# EAGLE design PCB Design (EAGLE 9.1.3)

## Sheet 1 of 2
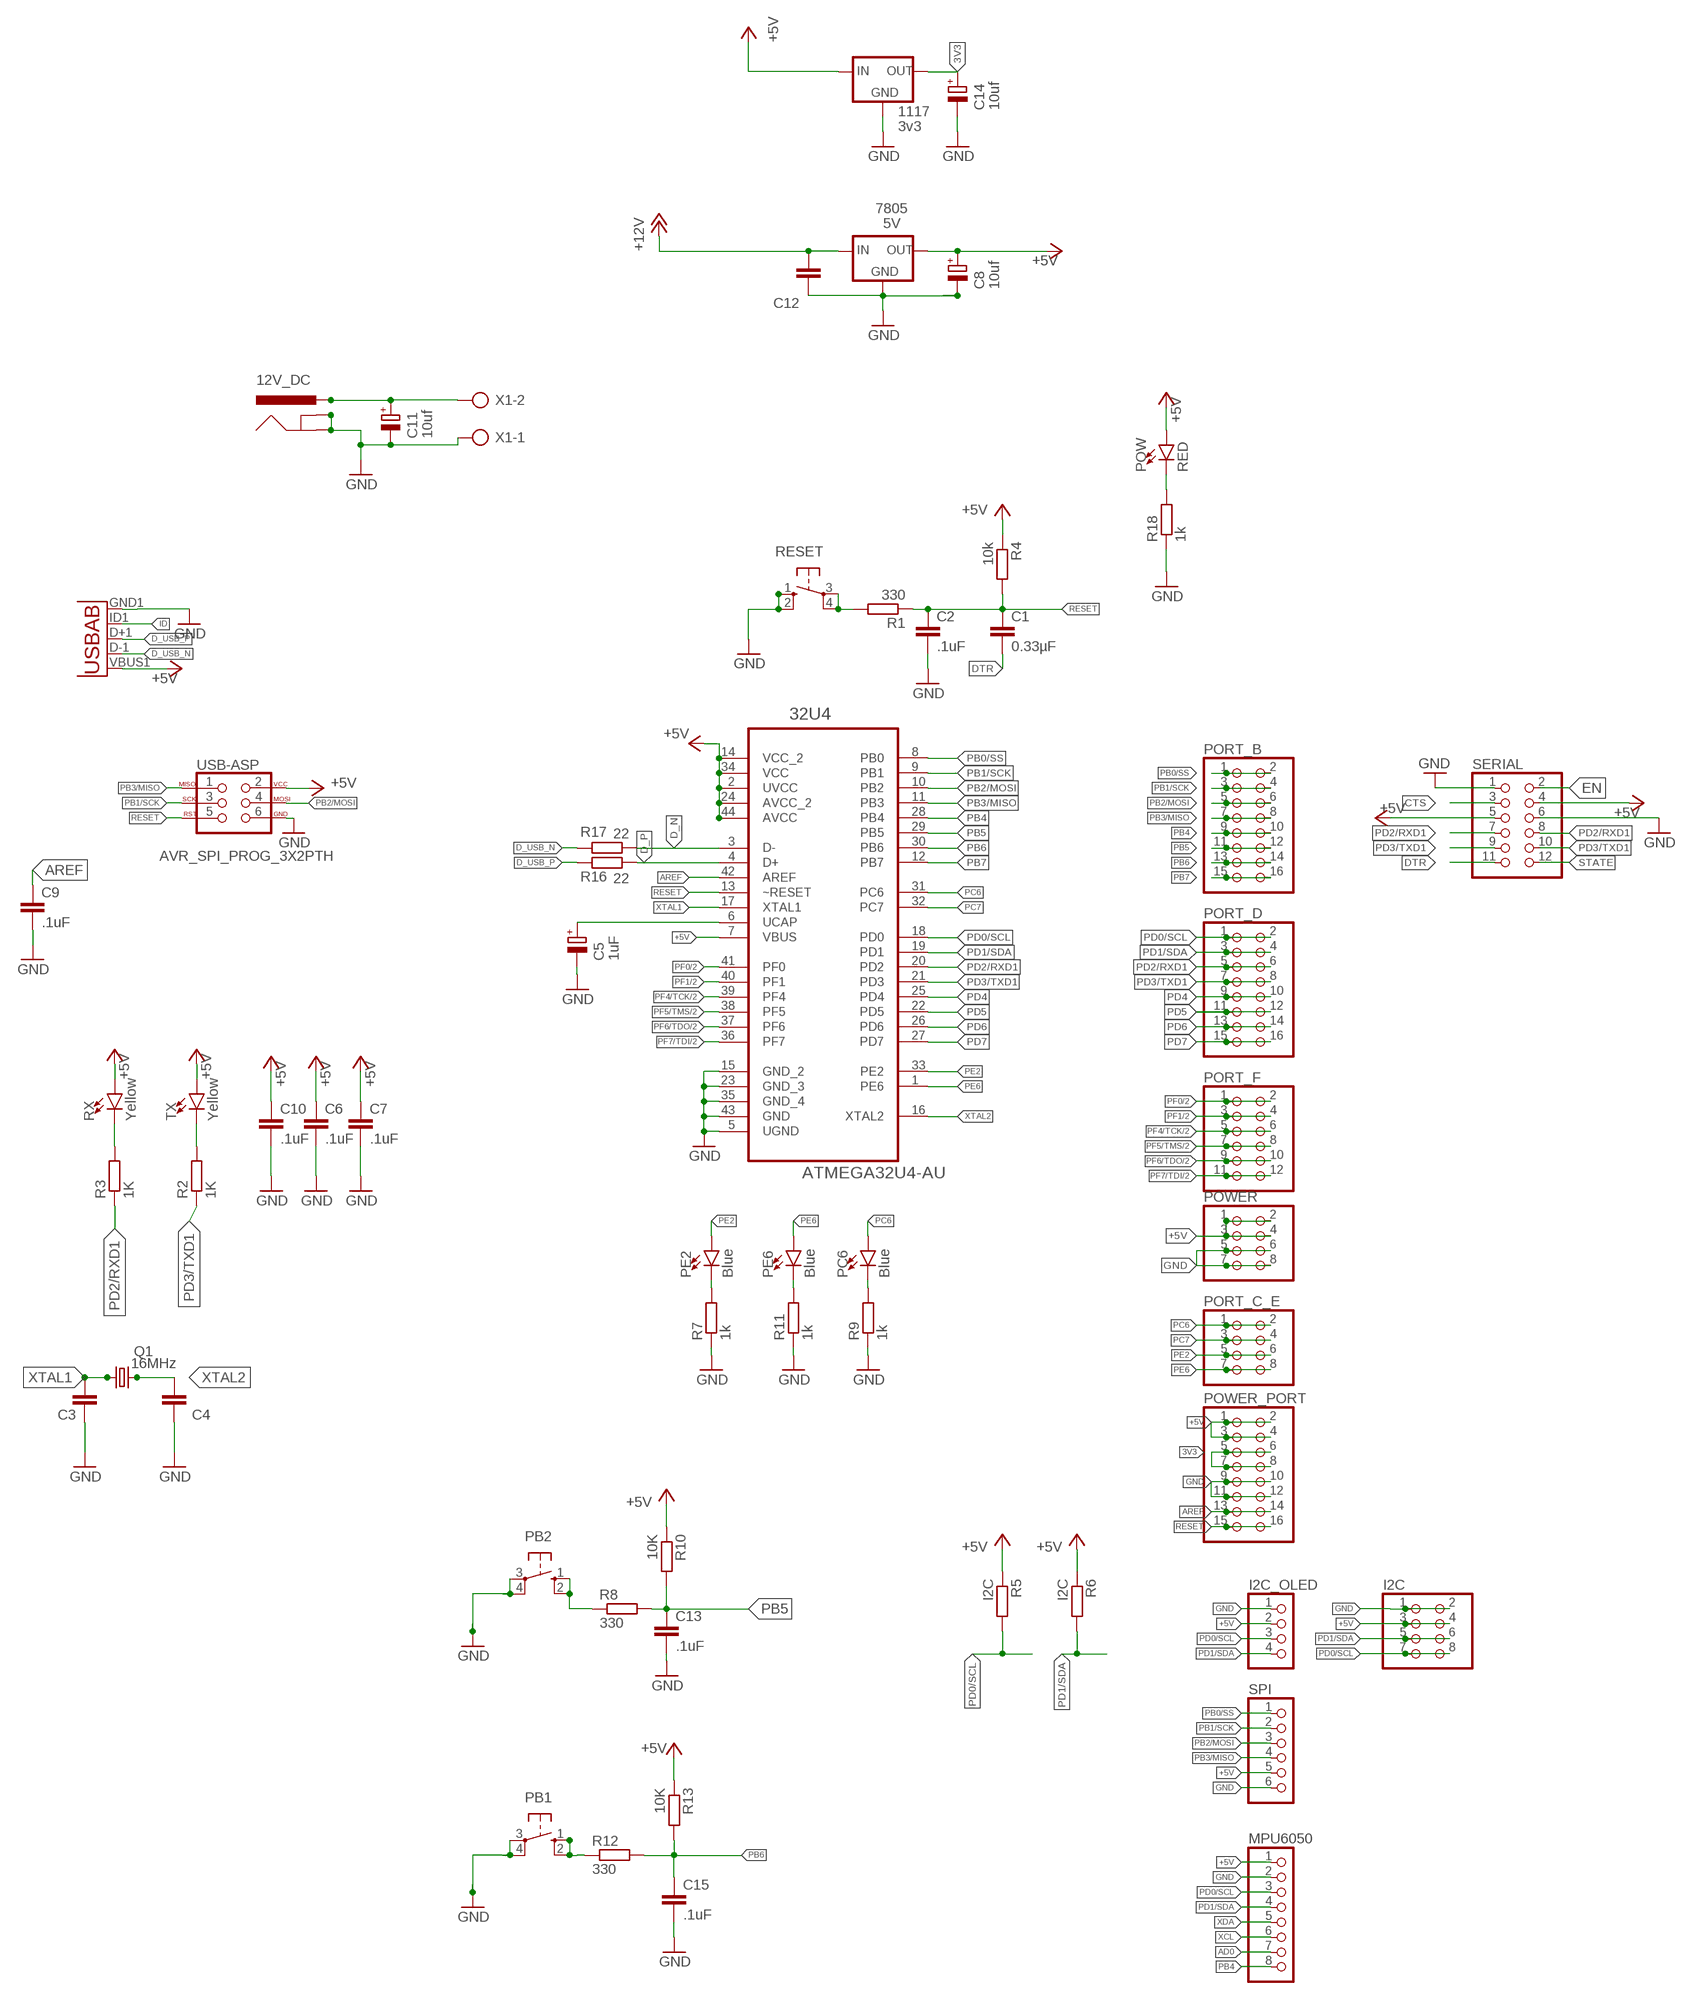
[diagram p0: schematic, sheet 1]

### Parts
12V_DC  POWER_JACK  [POWER_JACK_PTH]
32U4  ATMEGA32U4-AU  [QFP80P1200X1200X120-44N]
1117  3v3  V_REG_LD1117VXXLD1117-SMD  [SOT223]
7805  5V  V_REG_78XX7812  [TO-252]
C1  0.33µF  C-EUC0805K  [C0805K]
C2  .1uF  C-EUC0805K  [C0805K]
C3  22pF  C-EUC0805K  [C0805K]
C4  22pF  C-EUC0805K  [C0805K]
C5  1uF  CPOL-EUE2.5-6  [E2,5-6]
C6  .1uF  C-EUC0805K  [C0805K]
C7  .1uF  C-EUC0805K  [C0805K]
C8  10uf  CPOL-EUE2.5-6  [E2,5-6]
C9  .1uF  C-EUC0805K  [C0805K]
C10  .1uF  C-EUC0805K  [C0805K]
C11  10uf  CPOL-EUE2.5-6  [E2,5-6]
C12  .1uf  C-EUC0805K  [C0805K]
C13  .1uF  C-EUC0805K  [C0805K]
C14  10uf  CPOL-EUE2.5-6  [E2,5-6]
C15  .1uF  C-EUC0805K  [C0805K]
I2C  PINHD-2X4  [2X04]
I2C_OLED  PINHD-1X4  [1X04]
MPU6050  PINHD-1X8  [1X08]
PB1  10-XX  [B3F-10XX]
PB2  10-XX  [B3F-10XX]
PC6  Blue  LED-BLUE0603  [LED-0603]
PE2  Blue  LED-BLUE0603  [LED-0603]
PE6  Blue  LED-BLUE0603  [LED-0603]
PORT_B  PINHD-2X8  [2X08]
PORT_C_E  PINHD-2X4  [2X04]
PORT_D  PINHD-2X8  [2X08]
PORT_F  PINHD-2X6  [2X06]
POW  RED  LED-BLUE0603  [LED-0603]
POWER  PINHD-2X4  [2X04]
POWER_PORT  PINHD-2X8  [2X08]
Q1  16MHz  CRYSTALHC49U70  [HC49U70]
R1  330  R-EU_M0805  [M0805]
R2  1K  R-EU_M0805  [M0805]
R3  1K  R-EU_M0805  [M0805]
R4  10k  R-EU_M0805  [M0805]
R5  I2C  R-EU_M0805  [M0805]
R6  I2C  R-EU_M0805  [M0805]
R7  1k  R-EU_M0805  [M0805]
R8  330  R-EU_M0805  [M0805]
R9  1k  R-EU_M0805  [M0805]
R10  10K  R-EU_M0805  [M0805]
R11  1k  R-EU_M0805  [M0805]
R12  330  R-EU_M0805  [M0805]
R13  10K  R-EU_M0805  [M0805]
R16  22  R-EU_M0805  [M0805]
R17  22  R-EU_M0805  [M0805]
R18  1k  R-EU_M0805  [M0805]
RESET  10-XX  [B3F-10XX]
RX  Yellow  LED-BLUE0603  [LED-0603]
SERIAL  PINHD-2X6  [2X06]
SPI  PINHD-1X6  [1X06]
TX  Yellow  LED-BLUE0603  [LED-0603]
U1  USB""  [USB-MICRO-SMD]
USB-ASP  AVR_SPI_PROG_3X2PTH  [2X3]
X1  AK500/2-H  [AK500/2-H]

### Nets
3V3: 1117.2(OUT) C14.+ POWER_PORT.5 POWER_PORT.6 POWER_PORT.7 POWER_PORT.8
+5V: 32U4.2(UVCC) 32U4.7(VBUS) 32U4.14(VCC_2) 32U4.24(AVCC_2) 32U4.34(VCC) 32U4.44(AVCC) 1117.3(IN) 7805.2(OUT) C6.1 C7.1 C8.+ C10.1 I2C.3 I2C.4 I2C_OLED.2 MPU6050.1 POW.A POWER.1 POWER.2 POWER.3 POWER.4 POWER_PORT.1 POWER_PORT.2 POWER_PORT.3 POWER_PORT.4 R4.1 R5.1 R6.1 R10.1 R13.1 RX.A SERIAL.4 SERIAL.5 SPI.5 TX.A U1.VBUS1(VBUS) USB-ASP.2 ; also sheet 2
+12V: 12V_DC.PWR 7805.1(IN) C11.+ C12.1 X1.2
AD0: MPU6050.7
AREF: 32U4.42(AREF) C9.1 POWER_PORT.13 POWER_PORT.14
CTS: SERIAL.3
D_N: 32U4.3(D-) R17.1
D_P: 32U4.4(D+) R16.1
D_USB_N: R17.2 U1.D-1(D-)
D_USB_P: R16.2 U1.D+1(D+)
DTR: C1.2 SERIAL.11
EN: SERIAL.2
GND: 12V_DC.GND 12V_DC.GNDBREAK 32U4.5(UGND) 32U4.15(GND_2) 32U4.23(GND_3) 32U4.35(GND_4) 32U4.43(GND) 1117.1(GND) 7805.3(GND) C2.2 C3.1 C4.1 C5.- C6.2 C7.2 C8.- C9.2 C10.2 C11.- C12.2 C13.2 C14.- C15.2 I2C.1 I2C.2 I2C_OLED.1 MPU6050.2 PB1.3(P) PB1.4(P1) PB2.3(P) PB2.4(P1) POWER.5 POWER.6 POWER.7 POWER.8 POWER_PORT.9 POWER_PORT.10 POWER_PORT.11 POWER_PORT.12 R7.1 R9.1 R11.1 R18.1 RESET.1(S) RESET.2(S1) SERIAL.1 SERIAL.6 SPI.6 U1.GND1(GND) USB-ASP.6 X1.1 ; also sheet 2
ID: U1.ID1(USBID)
N$1: PC6.C R9.2
N$2: POW.C R18.2
N$3: PE6.C R11.2
N$7: PE2.C R7.2
N$8: R2.2 TX.C
N$9: R3.2 RX.C
N$10: R1.2 RESET.3(P) RESET.4(P1)
N$11: PB1.1(S) PB1.2(S1) R12.1
N$12: PB2.1(S) PB2.2(S1) R8.1
N$16: 32U4.6(UCAP) C5.+
PB0/SS: 32U4.8(PB0) PORT_B.1 PORT_B.2 SPI.1
PB1/SCK: 32U4.9(PB1) PORT_B.3 PORT_B.4 SPI.2 USB-ASP.3
PB2/MOSI: 32U4.10(PB2) PORT_B.5 PORT_B.6 SPI.3 USB-ASP.4
PB3/MISO: 32U4.11(PB3) PORT_B.7 PORT_B.8 SPI.4 USB-ASP.1
PB4: 32U4.28(PB4) MPU6050.8 PORT_B.9 PORT_B.10
PB5: 32U4.29(PB5) C13.1 PORT_B.11 PORT_B.12 R8.2 R10.2
PB6: 32U4.30(PB6) C15.1 PORT_B.13 PORT_B.14 R12.2 R13.2
PB7: 32U4.12(PB7) PORT_B.15 PORT_B.16
PC6: 32U4.31(PC6) PC6.A PORT_C_E.1 PORT_C_E.2
PC7: 32U4.32(PC7) PORT_C_E.3 PORT_C_E.4
PD0/SCL: 32U4.18(PD0) I2C.7 I2C.8 I2C_OLED.3 MPU6050.3 PORT_D.1 PORT_D.2 R5.2
PD1/SDA: 32U4.19(PD1) I2C.5 I2C.6 I2C_OLED.4 MPU6050.4 PORT_D.3 PORT_D.4 R6.2
PD2/RXD1: 32U4.20(PD2) PORT_D.5 PORT_D.6 R3.1 SERIAL.7 SERIAL.8
PD3/TXD1: 32U4.21(PD3) PORT_D.7 PORT_D.8 R2.1 SERIAL.9 SERIAL.10
PD4: 32U4.25(PD4) PORT_D.9 PORT_D.10
PD5: 32U4.22(PD5) PORT_D.11 PORT_D.12
PD6: 32U4.26(PD6) PORT_D.13 PORT_D.14
PD7: 32U4.27(PD7) PORT_D.15 PORT_D.16
PE2: 32U4.33(PE2) PE2.A PORT_C_E.5 PORT_C_E.6
PE6: 32U4.1(PE6) PE6.A PORT_C_E.7 PORT_C_E.8
PF0: 32U4.41(PF0) PORT_F.1 PORT_F.2 ; also sheet 2
PF1: 32U4.40(PF1) PORT_F.3 PORT_F.4 ; also sheet 2
PF4/TCK: 32U4.39(PF4) PORT_F.5 PORT_F.6 ; also sheet 2
PF5/TMS: 32U4.38(PF5) PORT_F.7 PORT_F.8 ; also sheet 2
PF6/TDO: 32U4.37(PF6) PORT_F.9 PORT_F.10 ; also sheet 2
PF7/TDI: 32U4.36(PF7) PORT_F.11 PORT_F.12 ; also sheet 2
RESET: 32U4.13(~RESET) C1.1 C2.1 POWER_PORT.15 POWER_PORT.16 R1.1 R4.2 USB-ASP.5
STATE: SERIAL.12
XCL: MPU6050.6
XDA: MPU6050.5
XTAL1: 32U4.17(XTAL1) C3.2 Q1.1
XTAL2: 32U4.16(XTAL2) C4.2 Q1.2

## Sheet 2 of 2
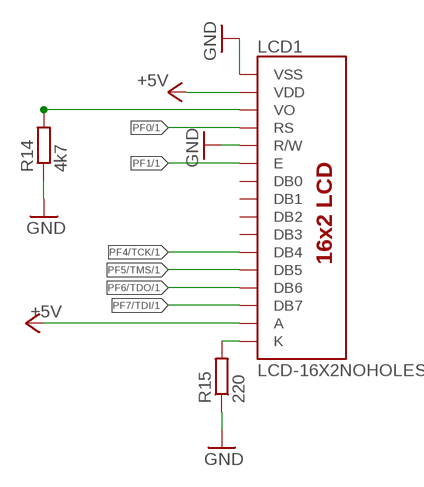
[diagram p1: schematic, sheet 2]

### Parts
LCD1  LCD-16X2NOHOLES  [LCD-16X2_NOHOLESNOSILK]
R14  4k7  R-EU_M0805  [M0805]
R15  220  R-EU_M0805  [M0805]

### Nets
+5V: LCD1.2(VDD) LCD1.15(A) ; also sheet 1
GND: LCD1.1(VSS) LCD1.5(R/W) R14.1 R15.1 ; also sheet 1
N$6: LCD1.3(VO) R14.2
N$14: LCD1.16(K) R15.2
PF0: LCD1.4(RS) ; also sheet 1
PF1: LCD1.6(E) ; also sheet 1
PF4/TCK: LCD1.11(DB4) ; also sheet 1
PF5/TMS: LCD1.12(DB5) ; also sheet 1
PF6/TDO: LCD1.13(DB6) ; also sheet 1
PF7/TDI: LCD1.14(DB7) ; also sheet 1
Unconnected: LCD1.7(DB0) LCD1.8(DB1) LCD1.9(DB2) LCD1.10(DB3)

## Library data of the parts
12V_DC = SparkFun-Connectors:POWER_JACK: Power Jack Connector This is the standard 5.5mm barrel jack for power. The PTH is the most common, proven, reliable, footprint. The Slot footprint only works if the mill layer is transmitted to the PCB fab house so be warned. Here are the connectors we sell at SparkFun: DC Barrel Power Jack/Connector <https://www.sparkfun.com/products/119> (PRT-00119) DC Barrel Power Jack/Connector (SMD) <https://www.sparkfun.com/products/12748> (PRT-12748) DC Barrel Jack Adapter - Breadboard Compatible <https://www.sparkfun.com/products/10811> (PRT-10811) It is used on this SparkFun product (and many, many others): SparkFun RedBoard - Programmed with Arduino <https://www.sparkfun.com/products/12757> (DEV-12757) Also, if you need a mating power supply or connector, please check these out: Wall Adapter Power Supply - 9VDC 650mA <https://www.sparkfun.com/products/298> (TOL-00298) DC Barrel Jack Adapter - Male <https://www.sparkfun.com/products/10287> (PRT-10287); MF: MULTICOMP; MPN: SPC21365; OC_FARNELL: 1310918; PROD_ID: CONN-08197
32U4 = ATMEGA32U4-AU:ATMEGA32U4-AU: 8-bit Microcontroller with ISP Flash and USB Controller; AVAILABILITY: Unavailable; DESCRIPTION: MCU 8-bit ATmega AVR RISC 32KB Flash 3.3V/5V 44-Pin TQFP; MF: Microchip; MP: ATMEGA32U4-AU; OC_FARNELL: unknown; PACKAGE: TQFP-44 Microchip; PRICE: None
1117 = SparkFun-IC-Power:V_REG_LD1117VXX: LD1117VXX voltage regulator. We carry the 3.3V version (COM-00526) in TO-220 package.; OC_FARNELL: unknown; PROD_ID: VREG-13917
7805 = SparkFun-IC-Power:V_REG_78XX: Voltage Regulator Standard 78xx regulator. IGO (Input Ground Output). Spark Fun Electronics SKU : COM-00107; OC_FARNELL: unknown; PROD_ID: VREG-12370; VALUE: +12v
C1-C4 C6 C7 C9 C10 C12 C13 C15 = rcl:C-EU: CAPACITOR, European symbol; OC_FARNELL: unknown
C5 C8 C11 C14 = resistor:CPOL-EU: POLARIZED CAPACITOR, European symbol; OC_FARNELL: unknown
I2C = pinhead:PINHD-2X4: PIN HEADER
I2C_OLED = pinhead:PINHD-1X4: PIN HEADER; OC_FARNELL: unknown
LCD1 = SparkFun-Displays:LCD-16X2: Standard text-only 16x2 parallel input LCD Basic 16 character by 2 line display. Typically utilizes the extremely common HD44780 parallel interface chipset SparkFun Products: Basic 16x2 Green <https://www.sparkfun.com/products/255> Basic 8x2 Green <https://www.sparkfun.com/products/11122>; OC_FARNELL: unknown; SF_ID: LCD-00255
MPU6050 = pinhead:PINHD-1X8: PIN HEADER; OC_FARNELL: unknown
PB1 PB2 RESET = switch-omron:10-XX: OMRON SWITCH; MF: OMRON; MPN: B3F-1000; OC_FARNELL: 176432; OC_NEWARK: 36M3542
PC6 PE2 PE6 POW RX TX = SparkFun-LED:LED-BLUE: Blue SMD LED Used in manufacturing of various products at SparkFun Packages: 0603 - SMD 0603 package [Product Link] <http://www.digikey.com/product-detail/en/SMLE12BC7TT86/511-1589-2-ND/1641808> 1206 - SMD1206 package [Product Link] <http://www.digikey.com/product-detail/en/lite-on-inc/LTST-C150TBKT/160-1643-1-ND/573584> SparkFun Products: ESP8266 Thing-Dev Board <https://www.sparkfun.com/products/13711> RedBoard <https://www.sparkfun.com/products/12757>; OC_FARNELL: unknown; PROD_ID: DIO-08575; VALUE: BLUE
PORT_B PORT_D POWER_PORT = pinhead:PINHD-2X8: PIN HEADER; OC_FARNELL: unknown
PORT_C_E POWER = pinhead:PINHD-2X4: PIN HEADER; OC_FARNELL: unknown
PORT_F = pinhead:PINHD-2X6: PIN HEADER; OC_FARNELL: unknown
Q1 = crystal:CRYSTAL: CRYSTAL; OC_FARNELL: unknown; OC_NEWARK: unknown
R1-R18 = resistor:R-EU_: RESISTOR, European symbol; OC_FARNELL: unknown
SERIAL = pinhead:PINHD-2X6: PIN HEADER
SPI = pinhead:PINHD-1X6: PIN HEADER; OC_FARNELL: unknown
U1 = MicroUSB:USB: This is a USB AB connector that is compatible with USB OTG. i.e. this connector can serve as a host or device
USB-ASP = SparkFun-Connectors:AVR_SPI_PROG_3X2: AVR ISP 6 Pin This is the reduced ISP connector for AVR programming. Common on Arduino. This footprint will take up less PCB space and can be used with a 10-pin to 6-pin adapter such as SKU: BOB-08508 **Special note about "TEST_POINT" package. The stop mask is on the top side, so if you want your programming test points to be on the bottom of your board, make sure to place this package on the bottom side of the board. This also ensure that the orientation to program from the bottom side will be correct. SparkFun Products: SparkFun ISP Pogo Adapter <https://www.sparkfun.com/products/11591> - NS Tiny AVR Programmer <https://www.sparkfun.com/products/11801> -PTH; OC_FARNELL: unknown
X1 = con-ptr500:AK500/2-H: CONNECTOR Aug. 2004 / PTR Meßtechnik: Die Bezeichnung der Serie AK505 wurde geändert. Es handelt sich hierbei um AK500 in horizontaler Ausführung.; OC_FARNELL: unknown; OC_NEWARK: unknown

## Board
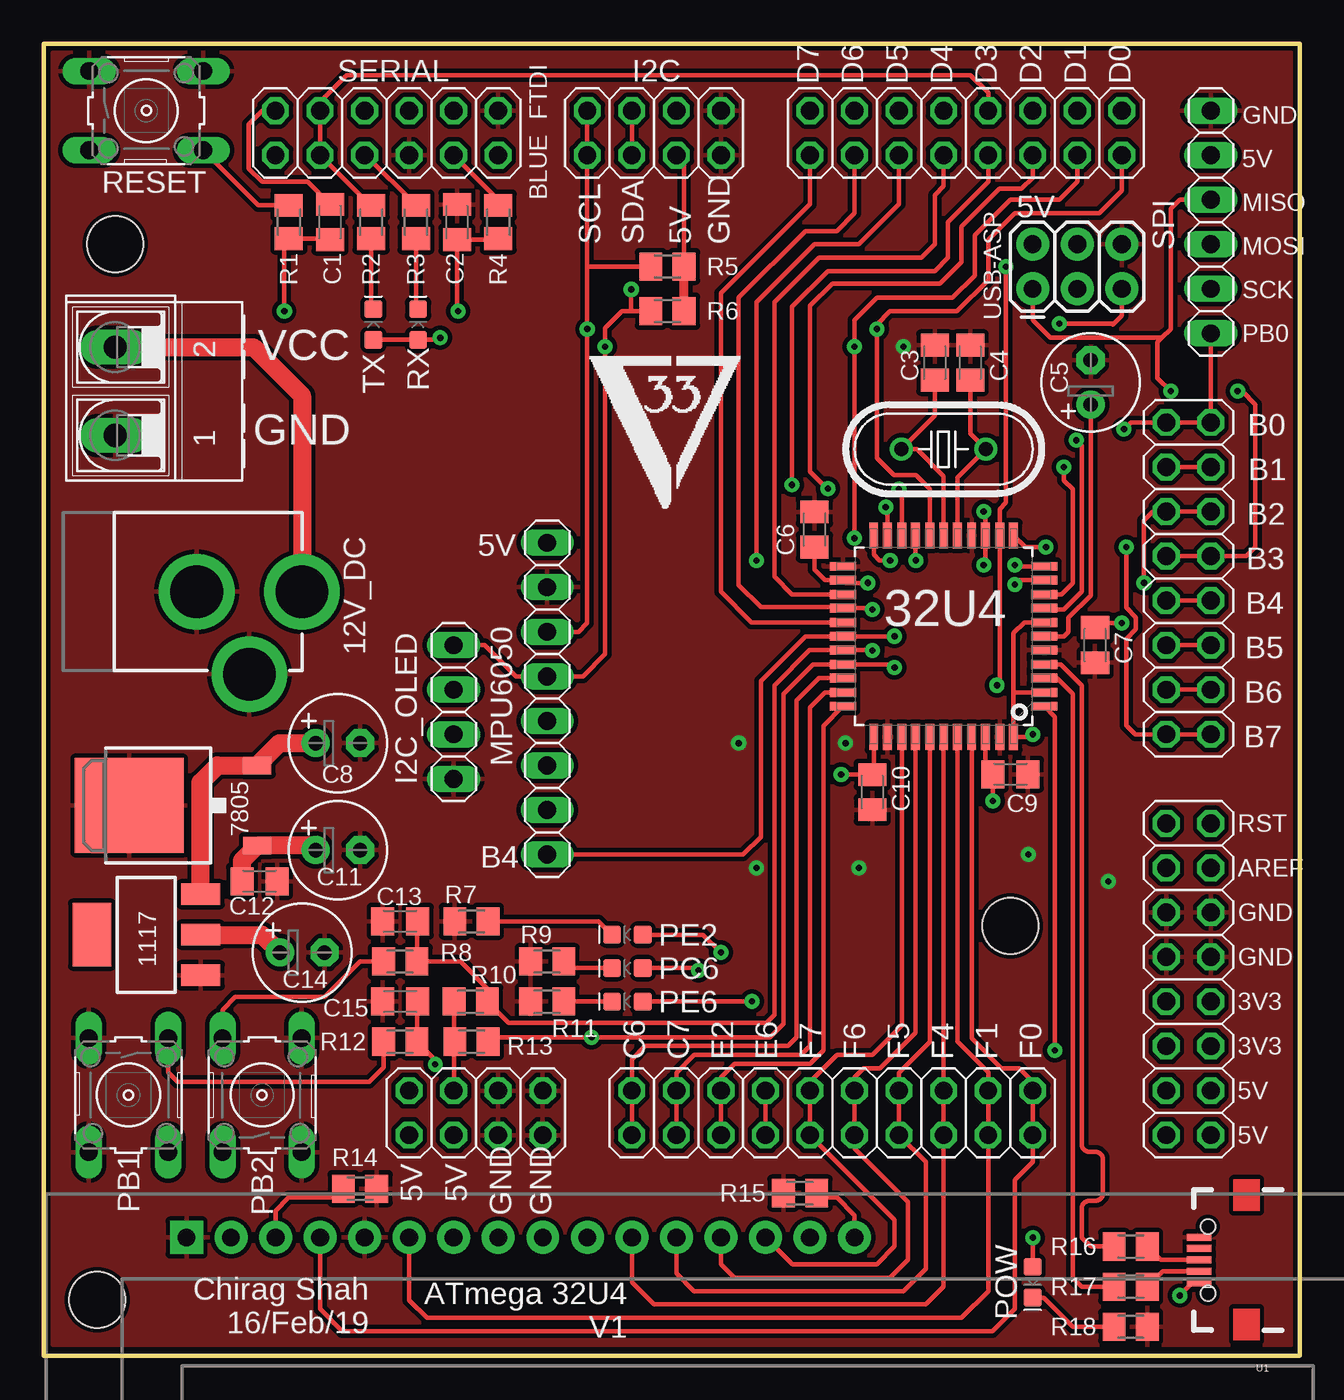
[diagram p2: board, top side]
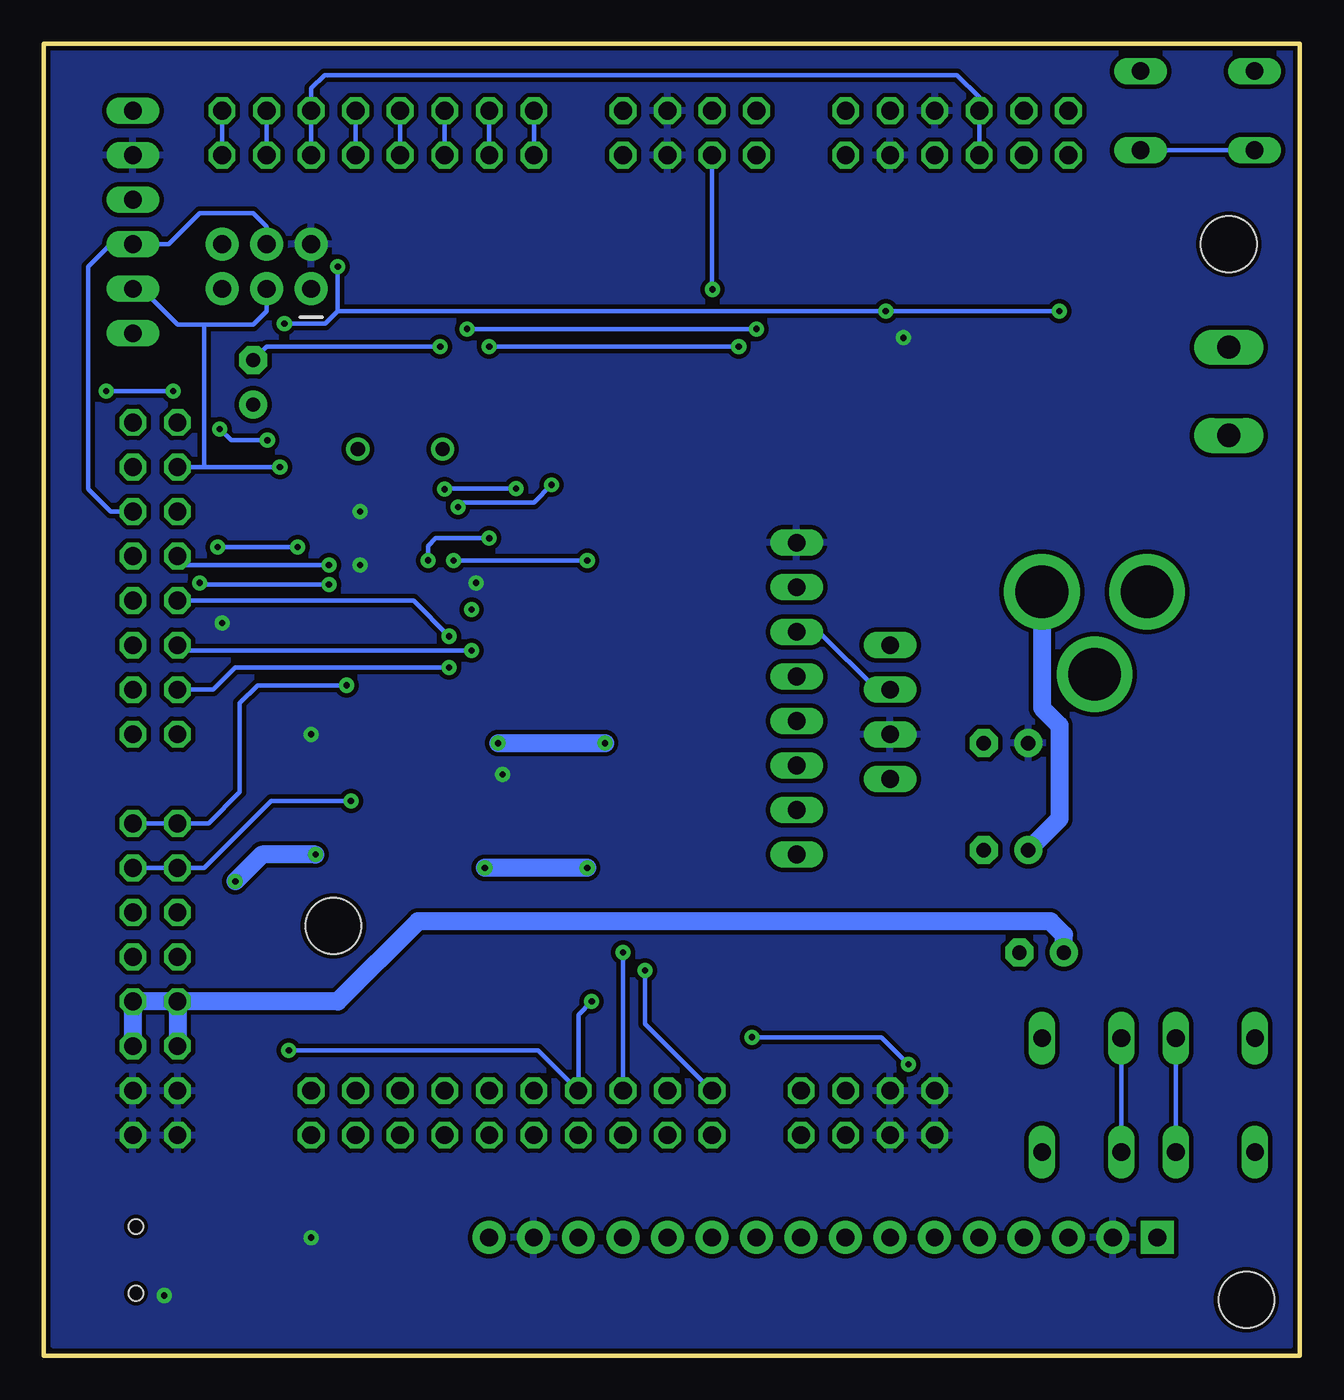
[diagram p3: board, bottom side, seen from below]

Size 71.63 x 74.8 mm. Coordinates in mm from the lower left corner, seen from the top.
Outline: 0,74.8 71.63,74.8 71.63,0 0,0 0,74.8
Copper layers (1*16): Top 0.035mm / dielectric 1.5mm / Bottom 0.035mm
Design rules "SparkFun-2-layer-STANDARD *": minimum track width 10mil, minimum drill 13.5mil, track to track 10mil, track to pad 8mil, pad to pad 8mil, via to via 10mil, smd to smd 8mil, copper to edge 8mil, drill to drill 8mil, minimum pad ring 10mil, minimum via ring 10mil, stop-mask expansion 4mil, vias tented up to drill 25mil, thermal gap 10mil
Holes 3.2 mm at 3.05,3.18 4.06,63.37 55.12,24.51

### Footprints (pad centres in the part's own frame; a part is rotated, then mirrored left to right if it is on the bottom)
POWER_JACK_PTH = drill 2.997 pad 4.318: GND 0,7.7; GNDBREAK 4.7,10.7; PWR 0,13.7
QFP80P1200X1200X120-44N = smd 1.473 x 0.508: 1 -5.74,3.988; 2 -5.74,3.2; 3 -5.74,2.388; 4 -5.74,1.6; 5 -5.74,0.787; 6 -5.74,0; 7 -5.74,-0.787; 8 -5.74,-1.6; 9 -5.74,-2.388; 10 -5.74,-3.2; 11 -5.74,-3.988; 23 5.74,-3.988; 24 5.74,-3.2; 25 5.74,-2.388; 26 5.74,-1.6; 27 5.74,-0.787; 28 5.74,0; 29 5.74,0.787; 30 5.74,1.6; 31 5.74,2.388; 32 5.74,3.2; 33 5.74,3.988 | smd 0.508 x 1.473: 12 -3.988,-5.74; 13 -3.2,-5.74; 14 -2.388,-5.74; 15 -1.6,-5.74; 16 -0.787,-5.74; 17 0,-5.74; 18 0.787,-5.74; 19 1.6,-5.74; 20 2.388,-5.74; 21 3.2,-5.74; 22 3.988,-5.74; 34 3.988,5.74; 35 3.2,5.74; 36 2.388,5.74; 37 1.6,5.74; 38 0.787,5.74; 39 0,5.74; 40 -0.787,5.74; 41 -1.6,5.74; 42 -2.388,5.74; 43 -3.2,5.74; 44 -3.988,5.74
SOT223 = smd 1.219 x 2.235: 1 -2.311,-3.099; 2 0,-3.099; 3 2.311,-3.099 | smd 3.6 x 2.2: 4 0,3.099
TO-252 = smd 1 x 1.6: 1 -2.28,-4.8; 2 2.28,-4.8 | smd 5.4 x 6.2: 3 0,2.5
C0805K = smd 1.3 x 1.6: 1 -1,0; 2 1,0
E2,5-6 = drill 0.813 pad 1.6: + -1.27,0 | drill 0.813 pad 1.6 octagon: - 1.27,0
2X04 = drill 1.016 octagon: 1 -3.81,-1.27; 2 -3.81,1.27; 3 -1.27,-1.27; 4 -1.27,1.27; 5 1.27,-1.27; 6 1.27,1.27; 7 3.81,-1.27; 8 3.81,1.27
1X04 = drill 1.016 long: 1 -3.81,0; 2 -1.27,0; 3 1.27,0; 4 3.81,0
LCD-16X2_NOHOLESNOSILK = drill 1.016 pad 1.88 square: 1 -32,15.5 | drill 1.016 pad 1.88: 2 -29.46,15.5; 3 -26.92,15.5; 4 -24.38,15.5; 5 -21.84,15.5; 6 -19.3,15.5; 7 -16.76,15.5; 8 -14.22,15.5; 9 -11.68,15.5; 10 -9.14,15.5; 11 -6.6,15.5; 12 -4.06,15.5; 13 -1.52,15.5; 14 1.02,15.5; 15 3.56,15.5; 16 6.1,15.5
1X08 = drill 1.016 long: 1 -8.89,0; 2 -6.35,0; 3 -3.81,0; 4 -1.27,0; 5 1.27,0; 6 3.81,0; 7 6.35,0; 8 8.89,0
B3F-10XX = drill 1.016 long: 1 -3.251,2.261; 2 3.251,2.261; 3 -3.251,-2.261; 4 3.251,-2.261
LED-0603 = smd 1 x 1: A -0.877,0; C 0.877,0
2X08 = drill 1.016 octagon: 1 -8.89,-1.27; 2 -8.89,1.27; 3 -6.35,-1.27; 4 -6.35,1.27; 5 -3.81,-1.27; 6 -3.81,1.27; 7 -1.27,-1.27; 8 -1.27,1.27; 9 1.27,-1.27; 10 1.27,1.27; 11 3.81,-1.27; 12 3.81,1.27; 13 6.35,-1.27; 14 6.35,1.27; 15 8.89,-1.27; 16 8.89,1.27
2X06 = drill 1.016 octagon: 1 -6.35,-1.27; 2 -6.35,1.27; 3 -3.81,-1.27; 4 -3.81,1.27; 5 -1.27,-1.27; 6 -1.27,1.27; 7 1.27,-1.27; 8 1.27,1.27; 9 3.81,-1.27; 10 3.81,1.27; 11 6.35,-1.27; 12 6.35,1.27
HC49U70 = drill 0.813: 1 -2.413,0; 2 2.413,0
M0805 = smd 1.3 x 1.6: 1 -0.95,0; 2 0.95,0
1X06 = drill 1.016 long: 1 -6.35,0; 2 -3.81,0; 3 -1.27,0; 4 1.27,0; 5 3.81,0; 6 6.35,0
USB-MICRO-SMD = smd 1.4 x 0.4: D+1 2.7,0; D-1 2.7,0.65; GND1 2.7,-1.3; ID1 2.7,-0.65; VBUS1 2.7,1.3 | hole 0.85: 2.2,1.9; 2.2,-1.9
2X3 = drill 1.016 pad 1.88: 1 0,0; 2 0,2.54; 3 2.54,0; 4 2.54,2.54; 5 5.08,0; 6 5.08,2.54
AK500/2-H = drill 1.321 long: 1 -2.515,0; 2 2.515,0

### Placement (x,y rotation side)
12V_DC  1.02,43.56 270 top
32U4  51.31,41.02 180 top
1117  5.84,24 90 top
7805  7.37,31.37 90 top
C1  16.32,64.64 90 top
C2  23.56,64.64 90 top
C3  50.8,56.63 270 top
C4  52.83,56.63 270 top
C5  59.69,55.5 90 top
C6  43.94,47.12 90 top
C7  59.94,40.51 270 top
C8  16.76,34.92 0 top
C9  55.12,33.15 0 top
C10  47.24,32.13 270 top
C11  16.76,28.83 0 top
C12  12.3,27.05 0 top
C13  20.32,24.77 180 top
C14  14.73,22.99 0 top
C15  20.32,20.19 180 top
I2C  34.8,69.72 180 top
I2C_OLED  23.37,36.7 90 top
LCD1  40.13,-8.76 0 top
MPU6050  28.7,37.47 270 top
PB1  4.83,14.86 270 top
PB2  12.45,14.86 90 top
PC6  33.27,22.1 180 top
PE2  33.27,24 180 top
PE6  33.27,20.19 180 top
PORT_B  65.28,44.32 270 top
PORT_C_E  37.34,13.84 0 top
PORT_D  52.58,69.72 180 top
PORT_F  50.04,13.84 180 top
POW  56.39,4.19 270 top
POWER  24.64,13.84 0 top
POWER_PORT  65.28,21.46 90 top
Q1  51.31,51.69 0 top
R1  13.97,64.64 90 top
R2  18.66,64.64 270 top
R3  21.22,64.64 270 top
R4  25.91,64.64 270 top
R5  35.56,62.1 180 top
R6  35.56,59.56 180 top
R7  24.38,24.77 0 top
R8  20.32,22.48 0 top
R9  28.7,22.48 0 top
R10  24.34,20.19 0 top
R11  28.7,20.19 0 top
R12  20.32,17.91 0 top
R13  24.38,17.91 0 top
R14  18.03,9.53 180 top
R15  43.12,9.27 0 top
R16  61.98,6.22 0 top
R17  61.98,3.94 0 top
R18  61.98,1.65 180 top
RESET  5.84,70.99 0 top
RX  21.34,58.8 90 top
SERIAL  19.56,69.72 180 top
SPI  66.55,64.64 90 top
TX  18.8,58.8 90 top
U1  68.58,5.46 180 top
USB-ASP  56.39,60.83 0 top
X1  4.06,54.99 90 top

### Tracks (layer width: path | path; a pad name or v marks a point on that pad's centre or on a via)
3V3
  Top 1.016: 1117.2 12.45,24 C14.+
  Bottom 1.016: POWER_PORT.5 POWER_PORT.7 POWER_PORT.8 | POWER_PORT.8 POWER_PORT.6 | C14.+ 13.46,24 14.22,24.77 50.29,24.77 54.86,20.19 POWER_PORT.8
+5V  (via drill 0.35)
  Top 0.254: v53.59,48.13 53.7,48.03 32U4.14 53.7,45.19 v53.59,45.09 | 32U4.34 47.32,33.21 C10.1 45.48,33.13 v45.47,33.15 | 32U4.7 55.91,41.81 55.3,41.2 55.3,37.72 | 55.3,37.72 32U4.44 56.24,35.28 v56.39,35.43 | 32U4.2 55.4,37.82 55.3,37.72 | R4.1 25.81,65.5 25.81,66.01 SERIAL.4 | TX.A RX.A 22.49,57.92 v22.61,58.04 | POWER.4 23.39,15.13 R10.1 23.39,17.95 R13.1 | 7805.2 | v46.99,44.07 45.72,44.07 32U4.24 44.55,44.22 43.94,44.83 C6.1 | POW.A v56.39,6.73 | U1.VBUS1 65.5,4.16 v64.77,3.43 | C7.1 60.2,41.77 v61.47,41.77 | I2C.4 36.51,68.01 R5.1
  Top 0.508: R6.1 R5.1
  Top 1.016: 7805.2 13.44,34.92 C8.+ | 1117.3 8.94,32.69 9.91,33.66 7805.2
  pour Bottom (isolate 0.254): 0.51,74.29 71.12,74.29 71.12,0.64 0.51,0.64
+12V
  Top 0.254: C11.+ 15.23,29.09
  Top 1.016: 15.23,29.09 7805.1 11.3,28.23 C12.1 | X1.2 10.16,57.51 11.96,57.51 14.72,54.75 12V_DC.PWR
  Bottom 1.016: 12V_DC.PWR 14.72,36.94 13.72,35.94 13.72,30.61 C11.+
AREF  (via drill 0.35)
  Top 0.254: v54.12,31.62 C9.1 53.7,33.57 32U4.42
  Bottom 0.254: POWER_PORT.13 POWER_PORT.14 62.48,27.81 58.67,31.62 v54.12,31.62
D_N
  Top 0.254: 32U4.3 57.76,38.63 58.67,37.72 58.67,4.45 59.18,3.94 R17.1
D_P
  Top 0.254: 32U4.4 57.99,39.42 59.18,38.23 59.18,12.07 arc90 59.63,11.62 59.95,11.62 arc-90 60.39,11.18 60.39,9.27 arc-90 59.95,8.83 59.63,8.83 arc90 59.18,8.38 59.18,6.73 59.69,6.22 R16.1
D_USB_N
  Top 0.254: U1.D-1 63.8,4.81 R17.2
D_USB_P
  Top 0.254: U1.D+1 65.79,5.46 63.69,5.46 R16.2
DTR
  Top 0.254: C1.2 15.03,66.93 12.45,66.93 11.68,67.69 11.68,70.23 12.45,70.99 SERIAL.11
GND  (via drill 0.35)
  Bottom 0.254: C5.- 58.93,57.53 v49.02,57.53 | 41.66,34.92 41.45,34.92
  Bottom 1.016: v40.64,27.81 v46.48,27.81 | v45.72,34.92 41.66,34.92 | 41.45,34.92 v39.62,34.92 | v56.13,28.57 59.18,28.57 v60.71,27.05
  pour Top (isolate 0.254): 71.12,0.64 71.12,74.29 0.51,74.29 0.51,0.64
N$1
  Top 0.254: PC6.C 30.03,22.1 R9.2
N$2
  Top 0.254: R18.2 58.67,1.65 57.01,3.31 POW.C
N$3
  Top 0.254: PE6.C R11.2
N$6
  Top 0.254: R14.2 16.58,9.02 13.97,9.02 13.21,8.26 13.21,8.25 LCD1.3
N$7
  Top 0.254: R7.2 31.63,24.77 PE2.C
N$8
  Top 0.254: R2.2 18.66,59.81 TX.C
N$9
  Top 0.254: R3.2 21.22,59.8 RX.C
N$10
  Top 0.254: R1.2 12.23,65.59 RESET.4
  Bottom 0.254: RESET.3 RESET.4
N$11
  Top 0.254: R12.1 19.37,16.45 18.54,15.62 7.62,15.62 7.09,16.15 PB1.1
  Bottom 0.254: PB1.2 PB1.1
N$12
  Top 0.254: R8.1 18.03,22.48 16,20.45 10.92,20.45 10.18,19.71 PB2.2
  Bottom 0.254: PB2.2 PB2.1
N$14
  Top 0.254: R15.2 44.32,9.02 45.21,9.02 46.23,8 LCD1.16
N$16
  Top 0.254: 32U4.6 58.17,41.02 58.42,41.27 58.42,42.08 59.69,43.35 C5.+
PB0/SS  (via drill 0.35)
  Top 0.254: 32U4.8 57.12,42.55 58.17,42.55 59.18,43.56 59.18,51.9 v58.88,52.2 | v61.59,52.83 61.98,53.21 PORT_B.1 PORT_B.2 SPI.1
  Bottom 0.254: v58.88,52.2 60.96,52.2 v61.59,52.83
PB1/SCK  (via drill 0.35)
  Top 0.254: PORT_B.4 PORT_B.3 | 32U4.9 58.01,43.41 58.67,44.07 58.67,49.4 58.17,49.91 v58.17,50.67
  Bottom 0.254: USB-ASP.3 58.93,59.56 59.69,58.8 62.48,58.8 | 62.48,58.8 64.01,58.8 66.04,60.83 SPI.2 | PORT_B.3 62.48,50.67 | 62.48,50.67 v58.17,50.67 | 62.48,58.8 62.48,50.67
PB2/MOSI  (via drill 0.35)
  Top 0.254: PORT_B.6 PORT_B.5 63.25,48.13 62.74,47.62 v62.74,44.07 | 32U4.10 55.37,44.22 v55.37,43.97
  Bottom 0.254: v62.74,44.07 62.64,43.97 v55.37,43.97 | USB-ASP.4 58.93,64.39 59.69,65.15 62.74,65.15 64.52,63.37 SPI.3 67.82,63.37 69.09,62.1 69.09,49.4 67.82,48.13 PORT_B.6
PB3/MISO  (via drill 0.35)
  Top 0.254: PORT_B.7 PORT_B.8 68.58,45.59 69.09,46.1 69.09,54.23 68.33,54.99 v68.07,54.99 | 32U4.11 55.45,45.01 v55.37,45.09 | SPI.4 64.77,65.91 64.26,65.41 64.26,58.55 63.75,58.04 | USB-ASP.1 56.39,59.05 57.4,58.04 63.75,58.04 | 63.75,58.04 63.5,57.79 63.5,55.75 v64.26,54.99
  Bottom 0.254: v55.37,45.09 63.5,45.09 PORT_B.7 | v64.26,54.99 v68.07,54.99
PB4  (via drill 0.35)
  Top 0.254: PORT_B.9 PORT_B.10 | v48.51,41.02 32U4.28 43.43,41.02 40.89,38.48 40.89,29.59 39.88,28.57 MPU6050.8
  Bottom 0.254: PORT_B.9 50.55,43.05 v48.51,41.02
PB5  (via drill 0.35)
  Top 0.254: PORT_B.11 PORT_B.12 | v47.24,40.21 47.22,40.23 32U4.29 43.66,40.23 41.66,38.23 41.66,19.43 41.2,18.97 26.51,18.97 R10.2 25.29,20.96 23.76,22.48 R8.2 21.27,24.71 C13.1
  Bottom 0.254: v47.24,40.21 63.71,40.21 PORT_B.11
PB6  (via drill 0.34, 0.35)
  Top 0.254: PORT_B.13 PORT_B.14 | v48.51,39.24 48.34,39.42 47.6,39.42 47.58,39.4 46.91,39.4 46.89,39.42 32U4.30 43.87,39.42 42.16,37.72 42.16,18.92 41.4,18.16 v31.24,18.16 25.59,18.16 R13.2 | v22.32,16.61 22.32,16.85 R12.2 21.27,20.14 C15.1
  Bottom 0.254: v48.51,39.24 60.71,39.24 61.98,37.97 62.48,37.97 PORT_B.13 | v22.32,16.61 23.88,18.16 v31.24,18.16
PB7  (via drill 0.34, 0.35)
  Top 0.254: PORT_B.16 PORT_B.15 62.23,35.43 61.72,35.94 61.72,40.88 62.28,41.43 62.28,42.1 61.72,42.66 v61.72,46.1 | 32U4.12 55.96,46.1 v57.15,46.1
  Bottom 0.254: v57.15,46.1 v61.72,46.1
PC6  (via drill 0.35)
  Top 0.254: 32U4.31 44.2,38.63 42.93,37.36 42.93,18.16 42.42,17.65 34.29,17.65 33.53,16.89 PORT_C_E.2 PORT_C_E.1 | PC6.A 37.21,22.1 v37.34,21.97
  Bottom 0.254: v37.34,21.97 37.34,18.92 PORT_C_E.2
PC7
  Top 0.254: PORT_C_E.3 PORT_C_E.4 36.07,16.13 37.08,17.14 43.18,17.14 43.69,17.65 43.69,36.96 44.55,37.82 32U4.32
PD0/SCL  (via drill 0.35)
  Top 0.254: 32U4.18 50.52,49.43 49.74,50.21 48.47,50.21 47.5,51.18 v47.5,58.55 47.5,58.8 48.26,59.56 52.07,59.56 53.85,61.34 53.85,63.63 55.37,65.15 60.2,65.15 61.47,66.42 PORT_D.2 | MPU6050.3 30.48,41.27 30.99,41.78 v30.99,58.55 30.99,62.1 | I2C.7 I2C.8 30.99,62.1 | R5.2 30.99,62.1
  Bottom 0.254: PORT_D.1 PORT_D.2 | v47.5,58.55 v30.99,58.55 | MPU6050.3 27.43,41.27 24.13,37.97 I2C_OLED.3
PD1/SDA  (via drill 0.35)
  Top 0.254: PORT_D.4 58.93,66.93 57.91,65.91 55.12,65.91 53.09,63.88 53.09,61.59 51.82,60.33 47.5,60.33 46.23,59.05 v46.23,57.53 v46.23,46.61 | 32U4.19 49.71,45.35 v49.72,45.35 | I2C_OLED.4 25.15,40.51 26.92,38.73 MPU6050.4 30.73,38.73 32,40.01 v32,57.53 32,58.59 32.97,59.56 33.53,59.56 | 33.53,59.56 R6.2 | I2C.5 I2C.6 | v33.5,60.8 33.5,59.59 33.53,59.56
  Bottom 0.254: v46.23,46.61 49.28,46.61 49.72,46.16 v49.72,45.35 | PORT_D.3 PORT_D.4 | I2C.6 33.53,60.83 v33.5,60.8 | v46.23,57.53 v32,57.53
PD2/RXD1  (via drill 0.35)
  Top 0.254: 32U4.20 48.92,49.25 v48.77,49.4 | PORT_D.6 56.39,67.18 55.75,66.55 54.48,66.55 52.32,64.39 52.32,62.36 51.1,61.13 44.96,61.13 43.69,59.87 43.69,50.42 44.66,49.45 v44.7,49.45 | SERIAL.8 18.36,68.45 R3.1
  Bottom 0.254: PORT_D.6 PORT_D.5 56.39,72.26 55.63,73.03 19.56,73.03 18.29,71.75 SERIAL.7 SERIAL.8 | v44.7,49.45 48.72,49.45 v48.77,49.4
PD3/TXD1  (via drill 0.34, 0.35)
  Top 0.254: 32U4.21 48.11,48.29 v48.01,48.39 | R2.1 18.61,65.59 SERIAL.10 SERIAL.9 15.75,71.5 17.27,73.03 52.83,73.03 53.85,72.01 PORT_D.7 | PORT_D.8 53.85,66.93 51.56,64.64 51.56,62.61 50.8,61.85 44.7,61.85 42.67,59.82 v42.67,49.66
  Bottom 0.254: v48.01,48.39 47.75,48.64 43.69,48.64 v42.67,49.66 | PORT_D.7 PORT_D.8
PD4
  Top 0.254: 32U4.25 42.67,43.41 41.66,44.42 41.66,60.07 44.2,62.61 50.04,62.61 50.8,63.37 50.8,66.17 51.31,66.67 PORT_D.10
  Bottom 0.254: PORT_D.9 PORT_D.10
PD5  (via drill 0.35)
  Top 0.254: PORT_D.12 48.77,65.66 46.48,63.37 43.94,63.37 40.64,60.07 v40.64,45.34 | 32U4.22 47.32,45.67 47.65,45.34 v48.26,45.34
  Bottom 0.254: PORT_D.11 PORT_D.12 | v48.26,45.34 v40.64,45.34
PD6  (via drill 0.35)
  Top 0.254: v47.24,42.55 47.17,42.62 32U4.26 45.57,42.68 45.58,42.69 40.89,42.69 39.62,43.95 39.62,60.33 43.43,64.13 45.21,64.13 46.23,65.15 PORT_D.14
  Bottom 0.254: PORT_D.13 PORT_D.14
PD7
  Top 0.254: 32U4.27 40.36,41.81 38.61,43.56 38.61,60.58 43.69,65.66 PORT_D.16
  Bottom 0.254: PORT_D.15 PORT_D.16
PE2  (via drill 0.35)
  Top 0.254: PORT_C_E.5 PORT_C_E.6 38.61,15.88 39.37,16.64 43.69,16.64 44.45,17.4 44.45,35.92 32U4.33 | PE2.A 37.59,24 v38.61,22.99
  Bottom 0.254: v38.61,22.99 38.61,21.97 PORT_C_E.6
PE6  (via drill 0.35)
  Top 0.254: PORT_C_E.8 PORT_C_E.7 | v57.66,17.4 57.66,36.42 32U4.1 | PE6.A v40.39,20.19
  Bottom 0.254: v57.66,17.4 43.43,17.4 PORT_C_E.8 41.15,19.43 v40.39,20.19
PF0
  Top 0.254: LCD1.4 15.75,2.67 17.02,1.4 54.1,1.4 55.37,2.67 55.37,10.03 56.39,11.05 PORT_F.2 PORT_F.1 56.39,15.62 55.63,16.38 54.61,16.38 52.91,18.09 32U4.41
PF1
  Top 0.254: 32U4.40 52.09,17.91 53.85,16.15 PORT_F.3 PORT_F.4 53.85,3.68 52.32,2.16 21.84,2.16 20.83,3.17 LCD1.6
PF4/TCK
  Top 0.254: LCD1.11 33.53,4.19 34.8,2.92 50.29,2.92 51.31,3.94 PORT_F.6 PORT_F.5 32U4.39
PF5/TMS
  Top 0.254: LCD1.12 36.07,4.7 37.08,3.68 49.02,3.68 50.29,4.95 50.29,11.05 PORT_F.8 PORT_F.7 48.77,16.13 50.52,17.88 32U4.38
PF6/TDO
  Top 0.254: LCD1.13 38.61,5.2 39.37,4.45 48.26,4.45 49.28,5.46 49.28,8.76 46.23,11.81 PORT_F.10 PORT_F.9 46.23,15.88 46.74,16.38 47.68,16.38 49.71,18.41 32U4.37
PF7/TDI
  Top 0.254: LCD1.14 42.68,5.21 47.5,5.21 48.51,6.22 48.51,7.75 PORT_F.12 PORT_F.11 43.69,15.62 45.21,17.14 47.24,17.14 48.92,18.82 32U4.36
RESET  (via drill 0.35)
  Top 0.254: v54.36,38.23 54.51,38.38 32U4.13 54.51,48.29 54.86,48.64 v54.86,62.1 | USB-ASP.5 61.47,59.31 60.96,58.8 60.91,58.85 v57.91,58.85 | C1.1 16.37,63.69 R1.1 13.72,63.44 v13.72,59.56 | R4.2 25.86,63.64 C2.1 23.56,59.62 v23.62,59.56
  Bottom 0.254: POWER_PORT.15 POWER_PORT.16 62.23,30.35 60.45,32.13 60.45,37.21 59.44,38.23 v54.36,38.23 | v57.91,58.85 55.58,58.85 54.86,59.56 | 54.86,59.56 v54.86,62.1 | 54.86,59.56 v23.62,59.56 21.97,59.56 v13.72,59.56
XTAL1
  Top 0.254: C3.2 50.8,53.59 Q1.1 49.78,51.69 51.31,50.16 32U4.17
XTAL2
  Top 0.254: 32U4.16 52.09,50.06 Q1.2 52.83,52.58 C4.2

### Text on the board
tPlace: D7 | D6 | D5 | D4 | D3 | D2 | D1 | D0 | GND | FTDI | 5V | 5V | MISO | BLUE | SCL | SDA | 5V | GND | MOSI | SCK | PB0 | VCC | B0 | GND | B1 | B2 | 5V | B3 | B4 | B5 | B6 | B7 | RST | AREF | B4 | GND | GND | 3V3 | 3V3 | C6 | C7 | E2 | E6 | F7 | F6 | F5 | F4 | F1 | F0 | 5V | 5V | 5V | 5V | GND | GND | Chirag Shah / 16/Feb/19 | ATmega 32U4 / V1